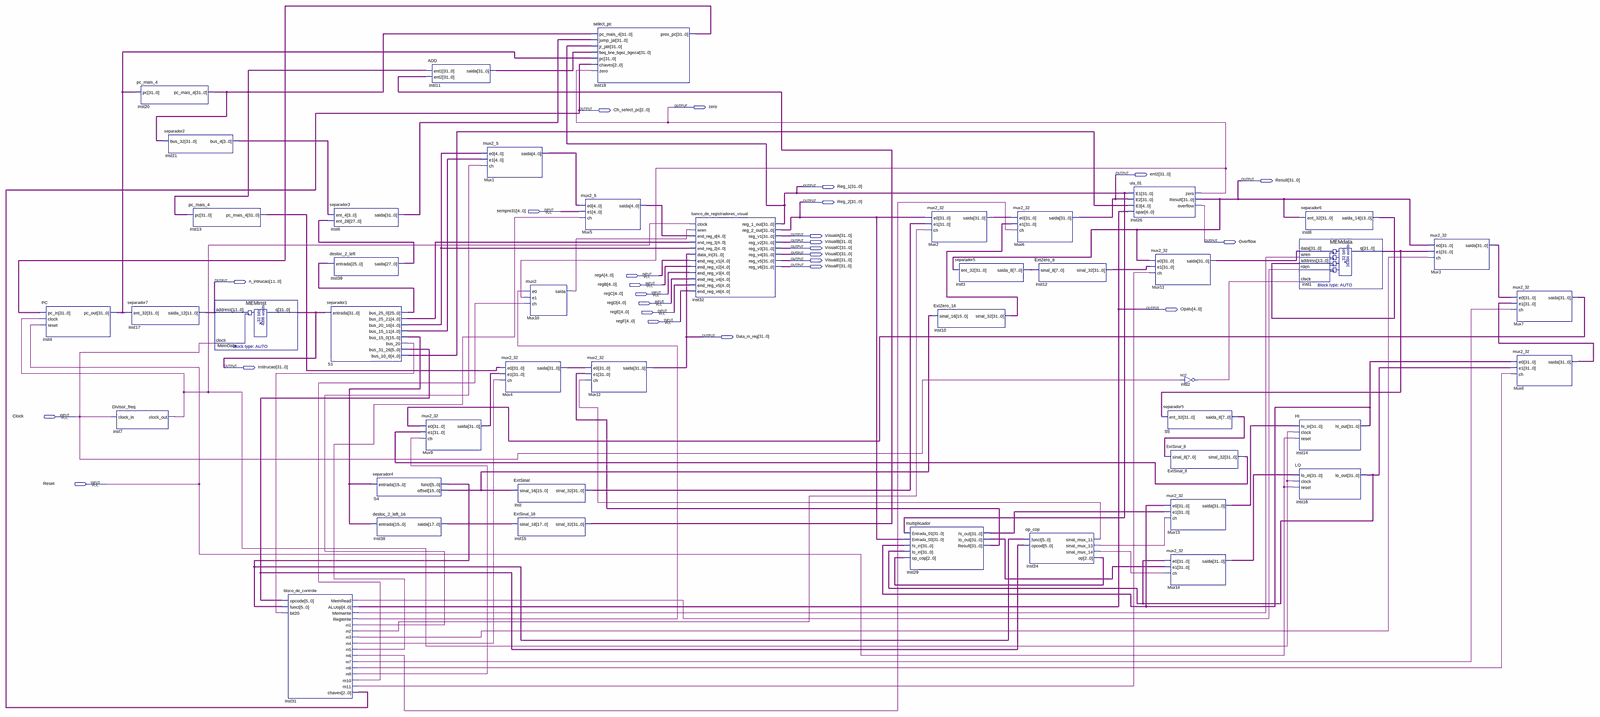
[diagram p0: schematic sheet, whole]
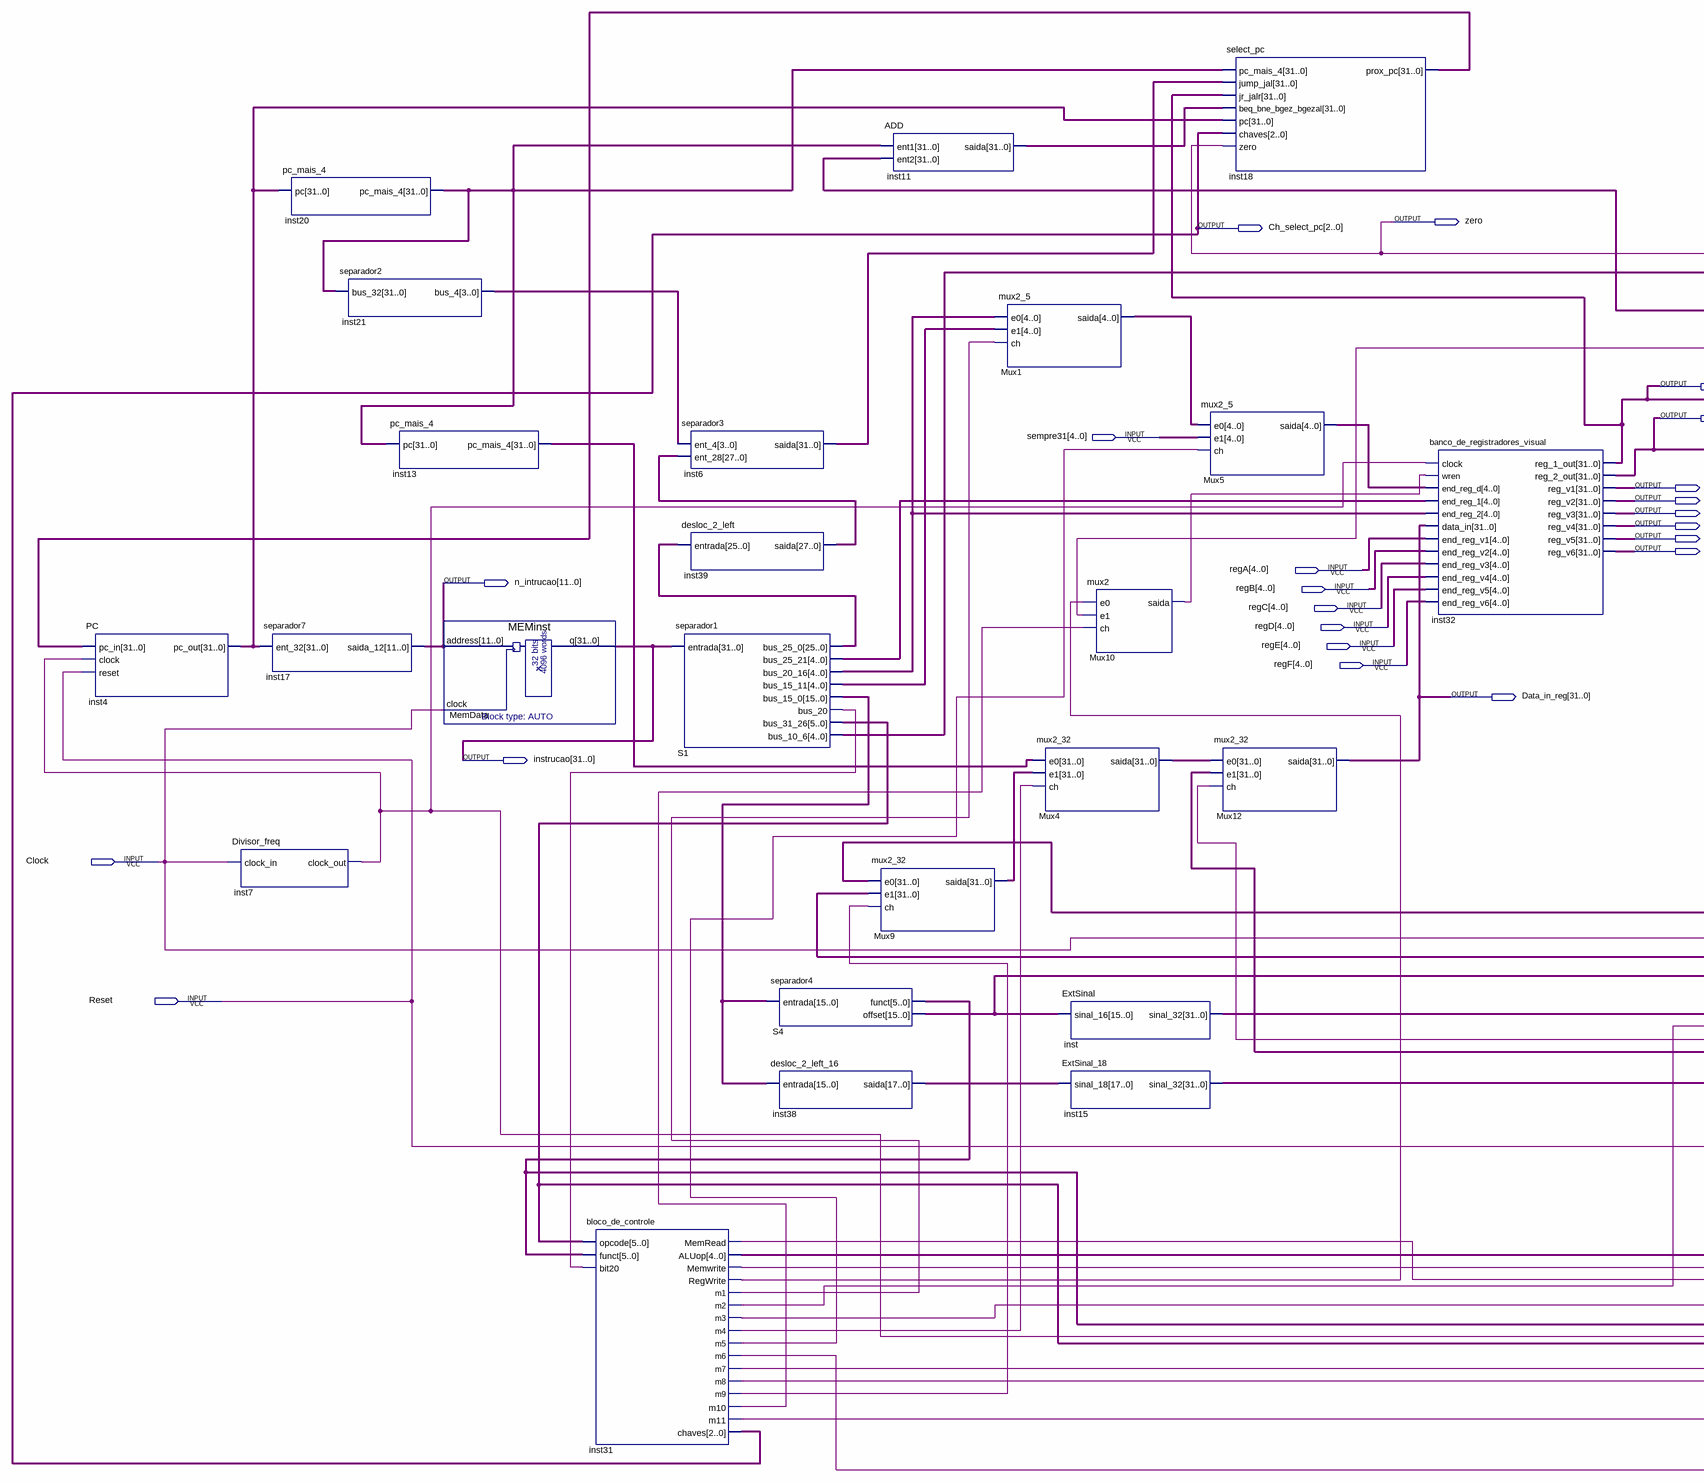
[diagram p1: schematic sheet, left part]
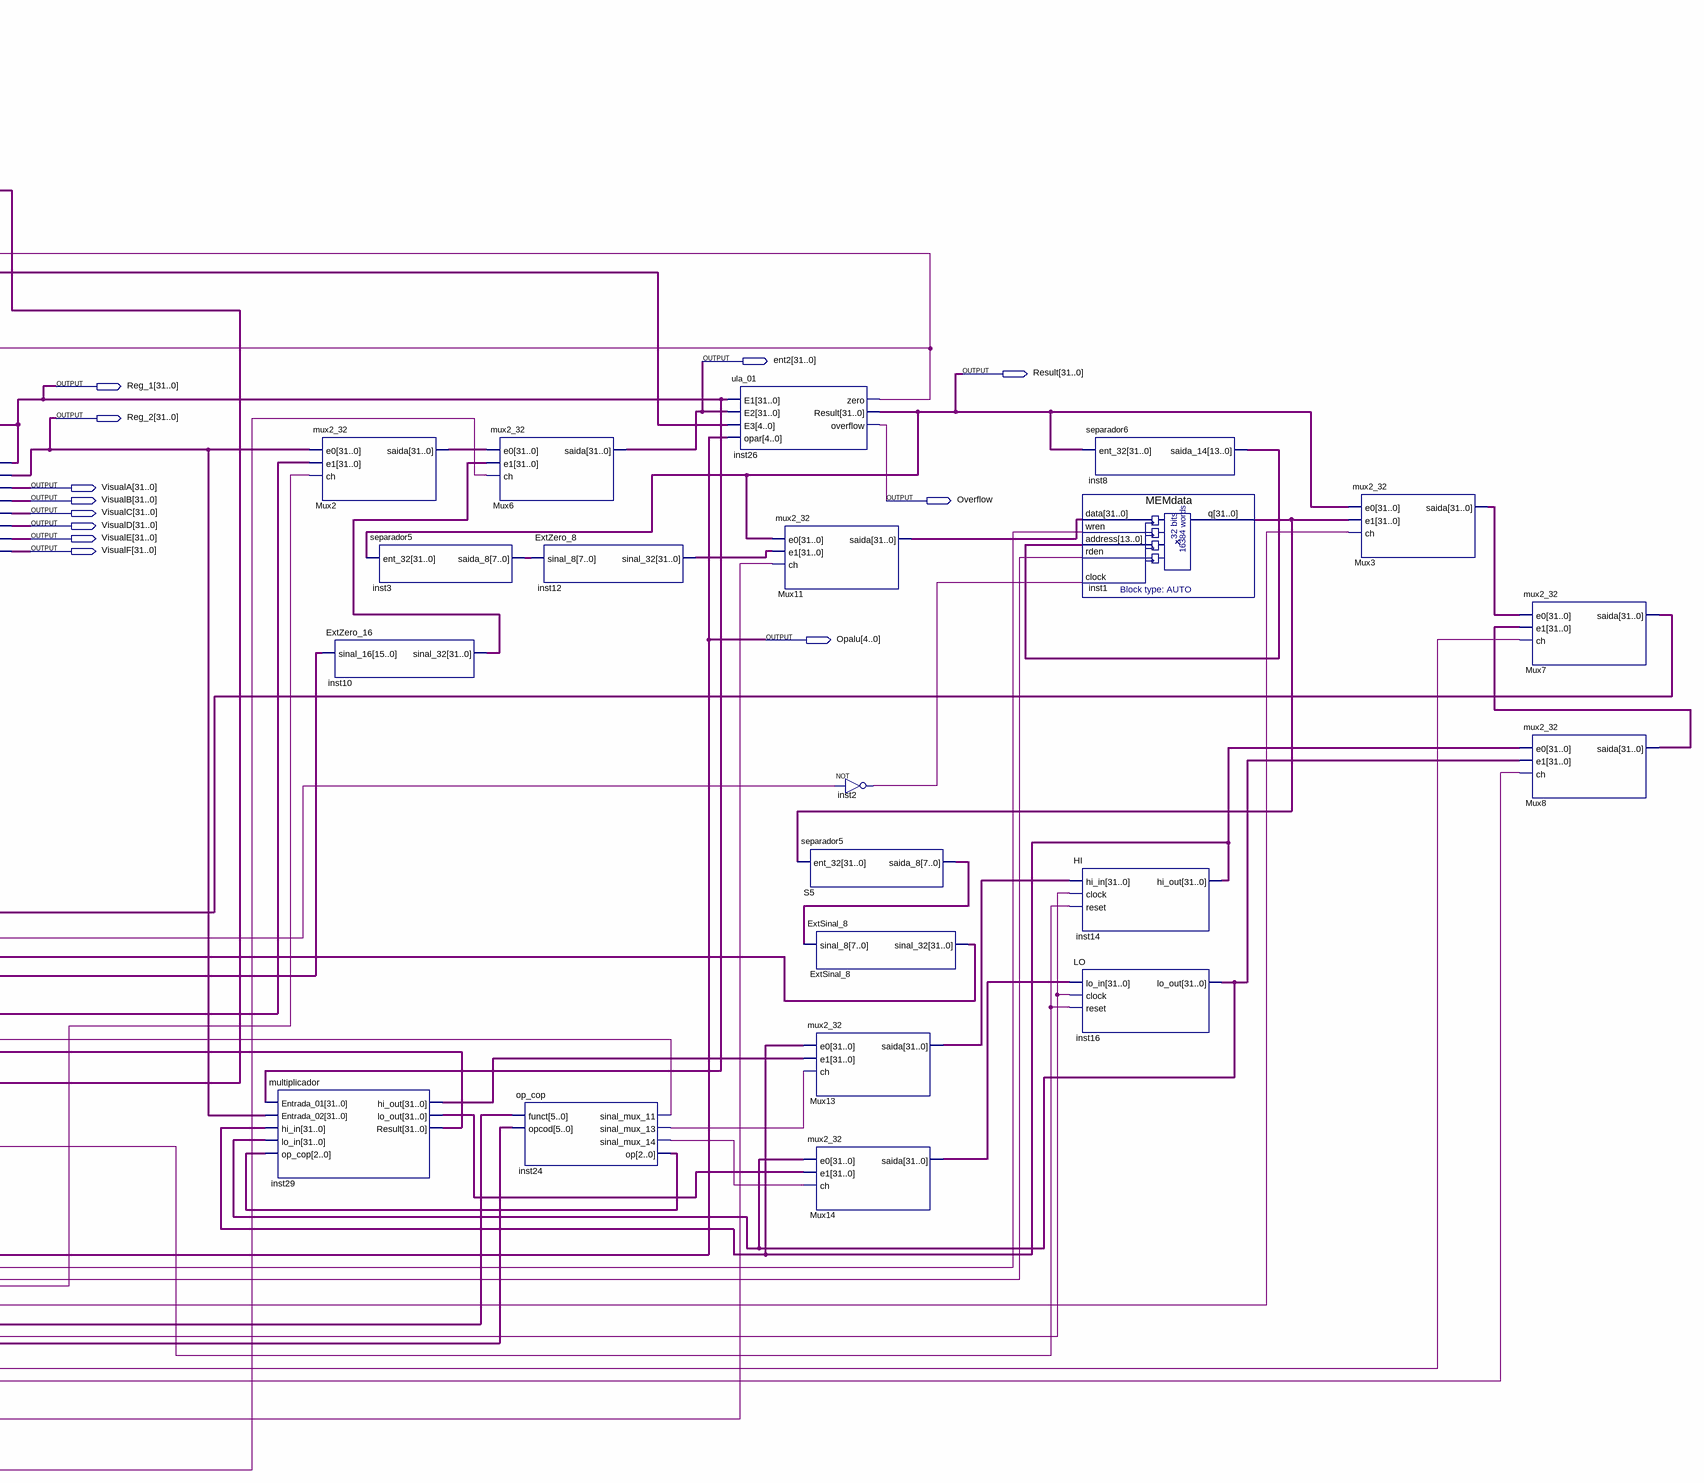
[diagram p2: schematic sheet, right part]
// Quartus schematic ProcessadorMips.bdf as structural Verilog: 45 symbols, 26 pins
module ProcessadorMips (
  input  [4:0] sempre31,
  input  [4:0] regA,
  input  [4:0] regB,
  input  [4:0] regC,
  input  [4:0] regD,
  input  [4:0] regE,
  input  [4:0] regF,
  input  Clock,
  input  Reset,
  output zero,
  output [2:0] Ch_select_pc,
  output [31:0] ent2,
  output [31:0] Result,
  output [31:0] Reg_1,
  output [31:0] Reg_2,
  output [31:0] VisualA,
  output [31:0] VisualB,
  output Overflow,
  output [31:0] VisualC,
  output [31:0] VisualD,
  output [31:0] VisualE,
  output [31:0] VisualF,
  output [11:0] n_intrucao,
  output [4:0] Opalu,
  output [31:0] Data_in_reg,
  output [31:0] instrucao
);

  wire inst2_out, inst7_clock_out, inst24_sinal_mux_11, inst24_sinal_mux_13, inst24_sinal_mux_14, inst31_m1,
       inst31_m2, inst31_m3, inst31_m4, inst31_m5, inst31_m6, inst31_m7, inst31_m8, inst31_m9, inst31_m10,
       inst31_m11, inst31_memread, inst31_memwrite, inst31_regwrite, Mux10_saida, S1_bus_20;
  wire [2:0] inst24_op;
  wire [3:0] inst21_bus_4;
  wire [4:0] Mux1_saida, Mux5_saida, S1_bus_10_6, S1_bus_15_11, S1_bus_20_16, S1_bus_25_21;
  wire [5:0] S1_bus_31_26, S4_funct;
  wire [7:0] inst3_saida_8, S5_saida_8;
  wire [13:0] inst8_saida_14;
  wire [15:0] S1_bus_15_0, S4_offset;
  wire [17:0] inst38_saida;
  wire [25:0] S1_bus_25_0;
  wire [27:0] inst39_saida;
  wire [31:0] ExtSinal_8_sinal_32, inst1_q, inst4_pc_out, inst6_saida, inst10_sinal_32, inst11_saida,
       inst12_sinal_32, inst13_pc_mais_4, inst14_hi_out, inst15_sinal_32, inst16_lo_out, inst18_prox_pc,
       inst20_pc_mais_4, inst29_hi_out, inst29_lo_out, inst29_result, inst_sinal_32, Mux2_saida, Mux3_saida,
       Mux4_saida, Mux7_saida, Mux8_saida, Mux9_saida, Mux11_saida, Mux13_saida, Mux14_saida;

  PC inst4 (.pc_in(inst18_prox_pc), .clock(inst7_clock_out), .reset(Reset), .pc_out(inst4_pc_out));
  separador7 inst17 (.ent_32(inst4_pc_out), .saida_12(n_intrucao));
  Divisor_freq inst7 (.clock_in(Clock), .clock_out(inst7_clock_out));
  pc_mais_4 inst20 (.pc(inst4_pc_out), .pc_mais_4(inst20_pc_mais_4));
  separador2 inst21 (.bus_32(inst20_pc_mais_4), .bus_4(inst21_bus_4));
  pc_mais_4 inst13 (.pc(inst20_pc_mais_4), .pc_mais_4(inst13_pc_mais_4));
  MEMinst MemData (.address(n_intrucao), .clock(Clock), .q(instrucao));
  bloco_de_controle inst31 (
    .opcode(S1_bus_31_26), .funct(S4_funct), .bit20(S1_bus_20), .MemRead(inst31_memread), .ALUop(Opalu),
    .Memwrite(inst31_memwrite), .RegWrite(inst31_regwrite), .m1(inst31_m1), .m2(inst31_m2), .m3(inst31_m3),
    .m4(inst31_m4), .m5(inst31_m5), .m6(inst31_m6), .m7(inst31_m7), .m8(inst31_m8), .m9(inst31_m9),
    .m10(inst31_m10), .m11(inst31_m11), .chaves(Ch_select_pc));
  separador1 S1 (
    .entrada(instrucao), .bus_25_0(S1_bus_25_0), .bus_25_21(S1_bus_25_21), .bus_20_16(S1_bus_20_16),
    .bus_15_11(S1_bus_15_11), .bus_15_0(S1_bus_15_0), .bus_20(S1_bus_20), .bus_31_26(S1_bus_31_26),
    .bus_10_6(S1_bus_10_6));
  separador3 inst6 (.ent_4(inst21_bus_4), .ent_28(inst39_saida), .saida(inst6_saida));
  desloc_2_left inst39 (.entrada(S1_bus_25_0), .saida(inst39_saida));
  separador4 S4 (.entrada(S1_bus_15_0), .funct(S4_funct), .offset(S4_offset));
  desloc_2_left_16 inst38 (.entrada(S1_bus_15_0), .saida(inst38_saida));
  mux2_32 Mux9 (.e0(Mux7_saida), .e1(ExtSinal_8_sinal_32), .ch(inst31_m9), .saida(Mux9_saida));
  ADD inst11 (.ent1(inst20_pc_mais_4), .ent2(inst15_sinal_32), .saida(inst11_saida));
  mux2_5 Mux1 (.e0(S1_bus_20_16), .e1(S1_bus_15_11), .ch(inst31_m1), .saida(Mux1_saida));
  mux2_32 Mux4 (.e0(inst13_pc_mais_4), .e1(Mux9_saida), .ch(inst31_m4), .saida(Mux4_saida));
  ExtSinal inst (.sinal_16(S4_offset), .sinal_32(inst_sinal_32));
  ExtSinal_18 inst15 (.sinal_18(inst38_saida), .sinal_32(inst15_sinal_32));
  mux2 Mux10 (.e0(inst31_regwrite), .e1(zero), .ch(inst31_m10), .saida(Mux10_saida));
  select_pc inst18 (
    .pc_mais_4(inst20_pc_mais_4), .jump_jal(inst6_saida), .jr_jalr(Reg_1),
    .beq_bne_bgez_bgezal(inst11_saida), .pc(inst4_pc_out), .chaves(Ch_select_pc), .zero(zero),
    .prox_pc(inst18_prox_pc));
  mux2_5 Mux5 (.e0(Mux1_saida), .e1(sempre31), .ch(inst31_m5), .saida(Mux5_saida));
  mux2_32 Mux12 (.e0(Mux4_saida), .e1(inst29_result), .ch(inst24_sinal_mux_11), .saida(Data_in_reg));
  banco_de_registradores_visual inst32 (
    .clock(inst7_clock_out), .wren(Mux10_saida), .end_reg_d(Mux5_saida), .end_reg_1(S1_bus_25_21),
    .end_reg_2(S1_bus_20_16), .data_in(Data_in_reg), .end_reg_v1(regA), .end_reg_v2(regB), .end_reg_v3(regC),
    .end_reg_v4(regD), .end_reg_v5(regE), .end_reg_v6(regF), .reg_1_out(Reg_1), .reg_2_out(Reg_2),
    .reg_v1(VisualA), .reg_v2(VisualB), .reg_v3(VisualC), .reg_v4(VisualD), .reg_v5(VisualE), .reg_v6(VisualF));
  multiplicador inst29 (
    .Entrada_01(Reg_1), .Entrada_02(Reg_2), .hi_in(inst14_hi_out), .lo_in(inst16_lo_out), .op_cop(inst24_op),
    .hi_out(inst29_hi_out), .lo_out(inst29_lo_out), .Result(inst29_result));
  mux2_32 Mux2 (.e0(Reg_2), .e1(inst_sinal_32), .ch(inst31_m2), .saida(Mux2_saida));
  ExtZero_16 inst10 (.sinal_16(S4_offset), .sinal_32(inst10_sinal_32));
  separador5 inst3 (.ent_32(Result), .saida_8(inst3_saida_8));
  mux2_32 Mux6 (.e0(Mux2_saida), .e1(inst10_sinal_32), .ch(inst31_m6), .saida(ent2));
  ExtZero_8 inst12 (.sinal_8(inst3_saida_8), .sinal_32(inst12_sinal_32));
  op_cop inst24 (
    .funct(S4_funct), .opcod(S1_bus_31_26), .sinal_mux_11(inst24_sinal_mux_11),
    .sinal_mux_13(inst24_sinal_mux_13), .sinal_mux_14(inst24_sinal_mux_14), .op(inst24_op));
  ula_01 inst26 (
    .E1(Reg_1), .E2(ent2), .E3(S1_bus_10_6), .opar(Opalu), .zero(zero), .Result(Result), .overflow(Overflow));
  mux2_32 Mux11 (.e0(Result), .e1(inst12_sinal_32), .ch(inst31_m11), .saida(Mux11_saida));
  not inst2 (inst2_out, Clock);
  separador5 S5 (.ent_32(inst1_q), .saida_8(S5_saida_8));
  ExtSinal_8 ExtSinal_8 (.sinal_8(S5_saida_8), .sinal_32(ExtSinal_8_sinal_32));
  mux2_32 Mux13 (.e0(inst14_hi_out), .e1(inst29_hi_out), .ch(inst24_sinal_mux_13), .saida(Mux13_saida));
  mux2_32 Mux14 (.e0(inst16_lo_out), .e1(inst29_lo_out), .ch(inst24_sinal_mux_14), .saida(Mux14_saida));
  separador6 inst8 (.ent_32(Result), .saida_14(inst8_saida_14));
  MEMdata inst1 (
    .data(Mux11_saida), .wren(inst31_memwrite), .address(inst8_saida_14), .rden(inst31_memread),
    .clock(inst2_out), .q(inst1_q));
  HI inst14 (.hi_in(Mux13_saida), .clock(inst7_clock_out), .reset(Reset), .hi_out(inst14_hi_out));
  LO inst16 (.lo_in(Mux14_saida), .clock(inst7_clock_out), .reset(Reset), .lo_out(inst16_lo_out));
  mux2_32 Mux3 (.e0(Result), .e1(inst1_q), .ch(inst31_m3), .saida(Mux3_saida));
  mux2_32 Mux7 (.e0(Mux3_saida), .e1(Mux8_saida), .ch(inst31_m7), .saida(Mux7_saida));
  mux2_32 Mux8 (.e0(inst14_hi_out), .e1(inst16_lo_out), .ch(inst31_m8), .saida(Mux8_saida));
endmodule
